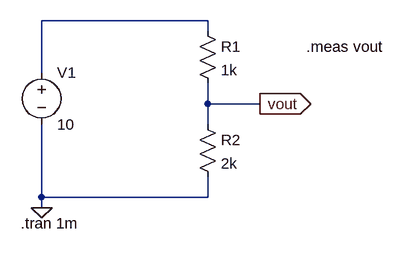
[diagram p0: schematic vdivider.asc]
vdivider.asc, the LTspice schematic file:
Version 4
SHEET 1 880 680
WIRE 240 48 -16 48
WIRE 240 64 240 48
WIRE -16 128 -16 48
WIRE 240 176 240 144
WIRE 320 176 240 176
WIRE 240 208 240 176
WIRE -16 320 -16 208
WIRE 240 320 240 288
WIRE 240 320 -16 320
WIRE -16 336 -16 320
FLAG -16 336 0
FLAG 320 176 vout
IOPIN 320 176 Out
SYMBOL voltage -16 112 R0
SYMATTR InstName V1
SYMATTR Value 10
SYMBOL res 224 48 R0
SYMATTR InstName R1
SYMATTR Value 1k
SYMBOL res 224 192 R0
SYMATTR InstName R2
SYMATTR Value 2k
TEXT -48 360 Left 2 !.tran 1m
TEXT 392 88 Left 2 !.meas vout

The netlist it stands for:
* vdivider.asc
V1 N001 0 10
R1 N001 vout 1k
R2 vout 0 2k
.tran 1m
.meas vout
.backanno
.end